# Altium project DAL_OBC_V11PrjPcb.PrjPcb (part 1 of 9)
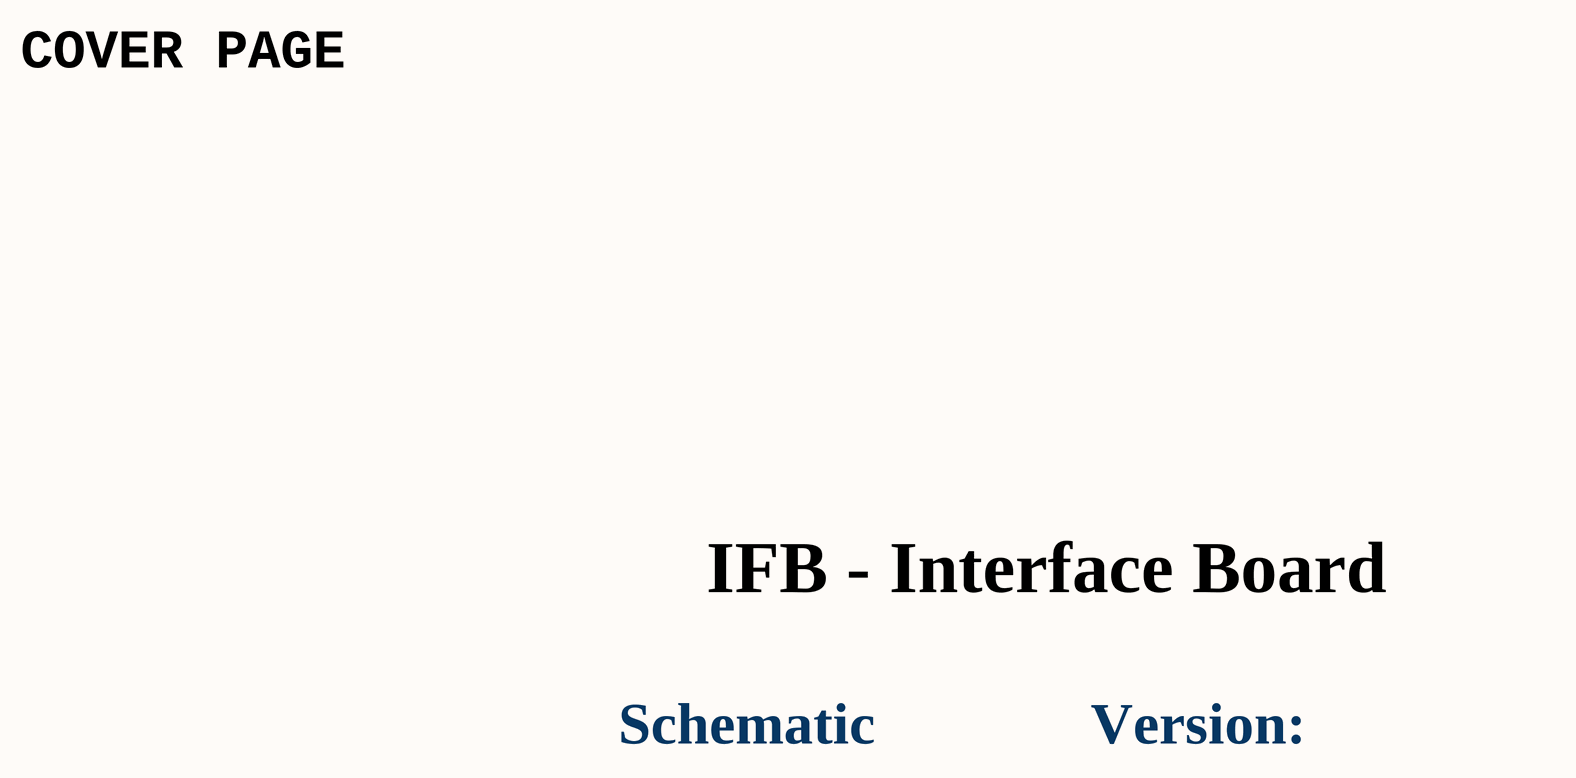
[diagram p0: CoverPage.SchDoc]
ApprovedBy: Vu Pham; CheckedBy: Bao Bui; Date: 09/09/2026; DrawnBy: Cam Doan; MasterProject: BEE-DAL; Revision: 1.1.0; SubSystem: OBC
34 sheets, 961 parts. Net scope: flat (ports and power ports of the same name join across sheets).
Board file: DAL_OBC_V10.PcbDoc
Sheets:
  CoverPage.SchDoc
  Index.SchDoc
  PowerTree.SchDoc
  BlockDiagram.SchDoc
  Power.SchDoc
  POWER_MANAGER.SchDoc
  CONNECTOR_IN.SchDoc
  CONNECTOR_BUS.SchDoc
  SAMA7G54_PMIC.SchDoc
  SAMA7G54_MPU.SchDoc
  SAMA7G54_PIO.SchDoc
  SAMA7G54_DDR3L.SchDoc
  SDCARD_MRAM.SchDoc
  eMMC.SchDoc
  USB_CAMERA_2.SchDoc
  USB_CAMERA.SchDoc
  DEBUG_CONSOLE.SchDoc
  TEMP.SchDoc
  RTC.SchDoc
  WATCHDOG.SchDoc
  CAN_PHY.SchDoc
  RS485.SchDoc
  RS422.SchDoc
  RS232.SchDoc
  BUTTON_LED.SchDoc
  MOUNTING_HOLE.SchDoc
  FPGA_POWER.SchDoc
  FPGA_POWER_2.SchDoc
  FPGA_BANK.SchDoc
  FPGA_FLASH_EEPROM.SchDoc
  FPGA_CONN_OUT.SchDoc
  ChangeNote.SchDoc
  MIPI_CSI.SchDoc
  NTC.SchDoc

## Sheet CoverPage.SchDoc
size 420 x 297 mm; SheetNumber: 1; SheetTotal: 34

### Notes on the sheet
- COVER PAGE
- IFB - Interface Board
- Schematic
- Version:
- Project:
- Sub-system:
- Design by:
- Sheet title:
- Sheet
- of
- Checked by:
- Approved by:
- Revision:
- Document No:
- Size:
- Date:
- A3

## Sheet Index.SchDoc
size 420 x 297 mm; SheetNumber: 2; SheetTotal: 34
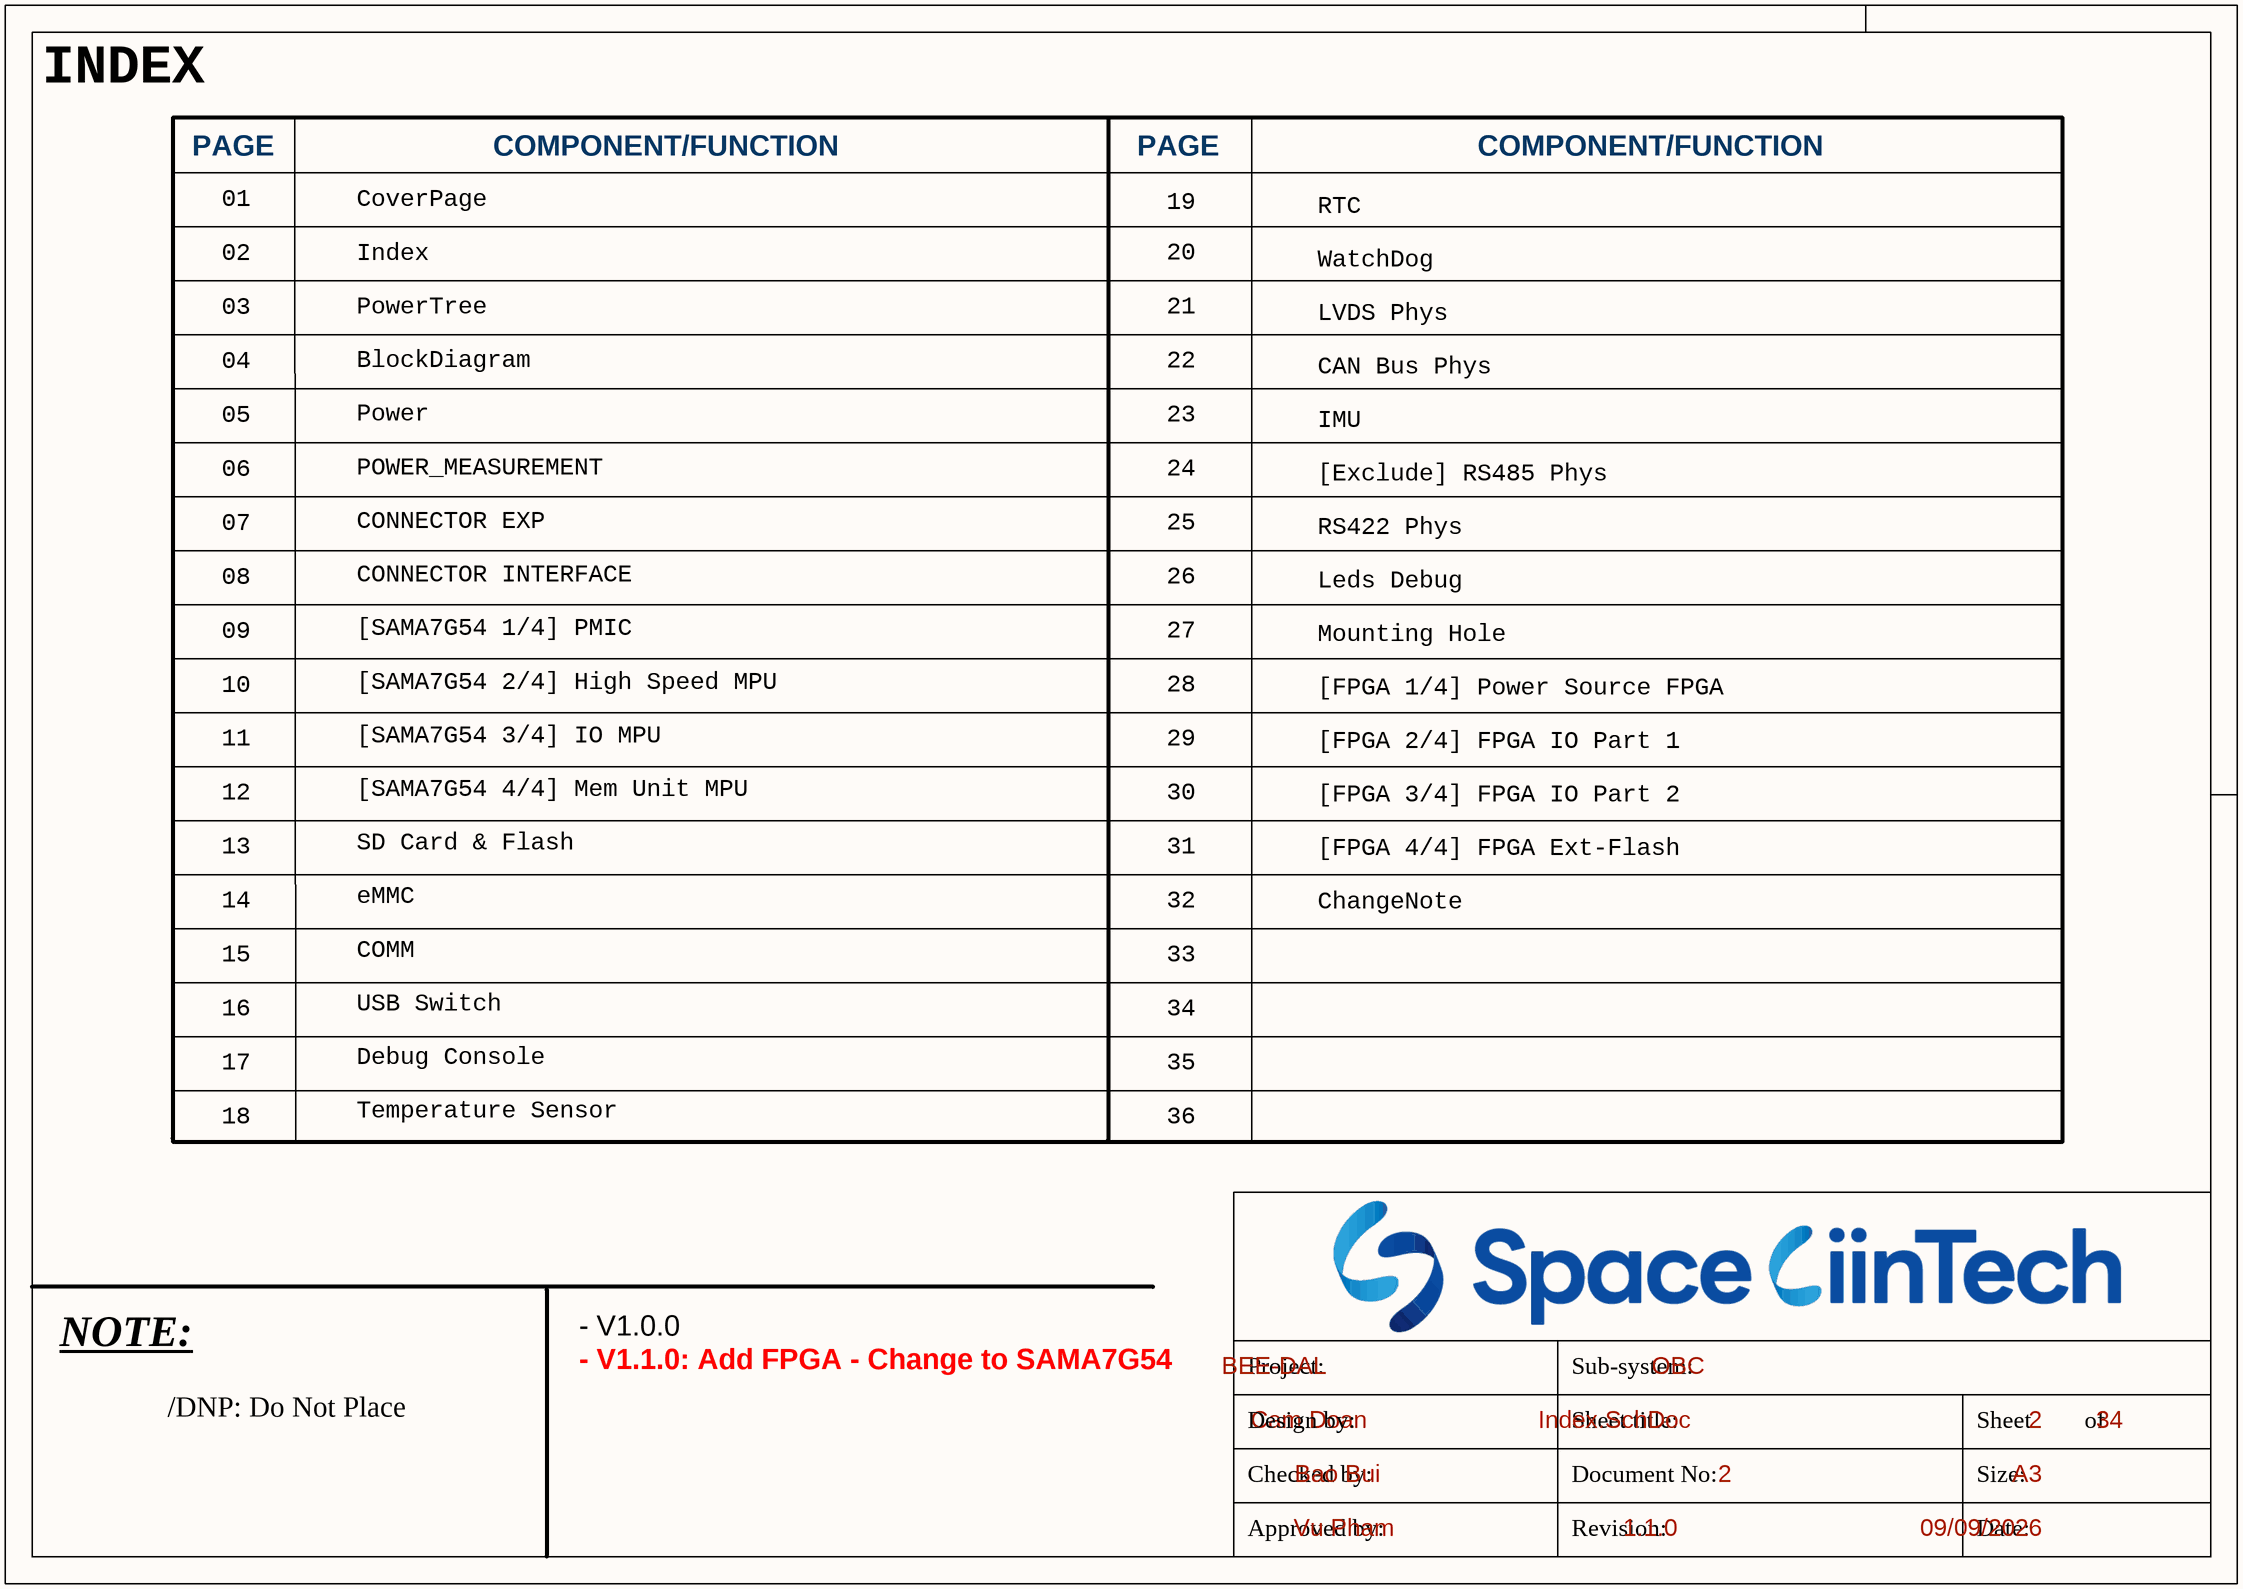
[diagram p1: Index.SchDoc]

### Notes on the sheet
- INDEX
- PAGE
- COMPONENT/FUNCTION
- 01
- 02
- CoverPage
- Index
- 19
- 20
- RTC
- 03
- PowerTree
- 21
- WatchDog
- LVDS Phys
- 04
- BlockDiagram
- 22
- CAN Bus Phys
- 05
- Power
- 23
- IMU
- 06
- 07
- CONNECTOR EXP
- POWER_MEASUREMENT
- 24
- 25
- [Exclude] RS485 Phys
- 08
- CONNECTOR INTERFACE
- 26
- RS422 Phys
- Leds Debug
- 09
- [SAMA7G54 1/4] PMIC
- 27
- Mounting Hole
- 10
- [SAMA7G54 2/4] High Speed MPU
- 28
- [FPGA 1/4] Power Source FPGA
- 11
- 12
- [SAMA7G54 3/4] IO MPU
- [SAMA7G54 4/4] Mem Unit MPU
- 29
- 30
- [FPGA 2/4] FPGA IO Part 1
- 13
- SD Card & Flash
- 31
- [FPGA 3/4] FPGA IO Part 2
- [FPGA 4/4] FPGA Ext-Flash
- 14
- eMMC
- 32
- ChangeNote
- 15
- COMM
- 33
- 16
- 17
- USB Switch
- Debug Console
- 34
- 35
- 18
- Temperature Sensor
- 36
- - V1.0.0
- NOTE:
- - V1.1.0: Add FPGA - Change to SAMA7G54
- /DNP: Do Not Place
- Project:
- Sub-system:
- Design by:
- Sheet title:
- Sheet
- of
- Checked by:
- Approved by:
- Revision:
- Document No:
- Size:
- Date:
- A3

## Sheet PowerTree.SchDoc
size 420 x 297 mm; SheetNumber: 3; SheetTotal: 34

### Notes on the sheet
- Project:
- Sub-system:
- Design by:
- Sheet title:
- Sheet
- of
- Checked by:
- Approved by:
- Revision:
- Document No:
- Size:
- Date:
- A3
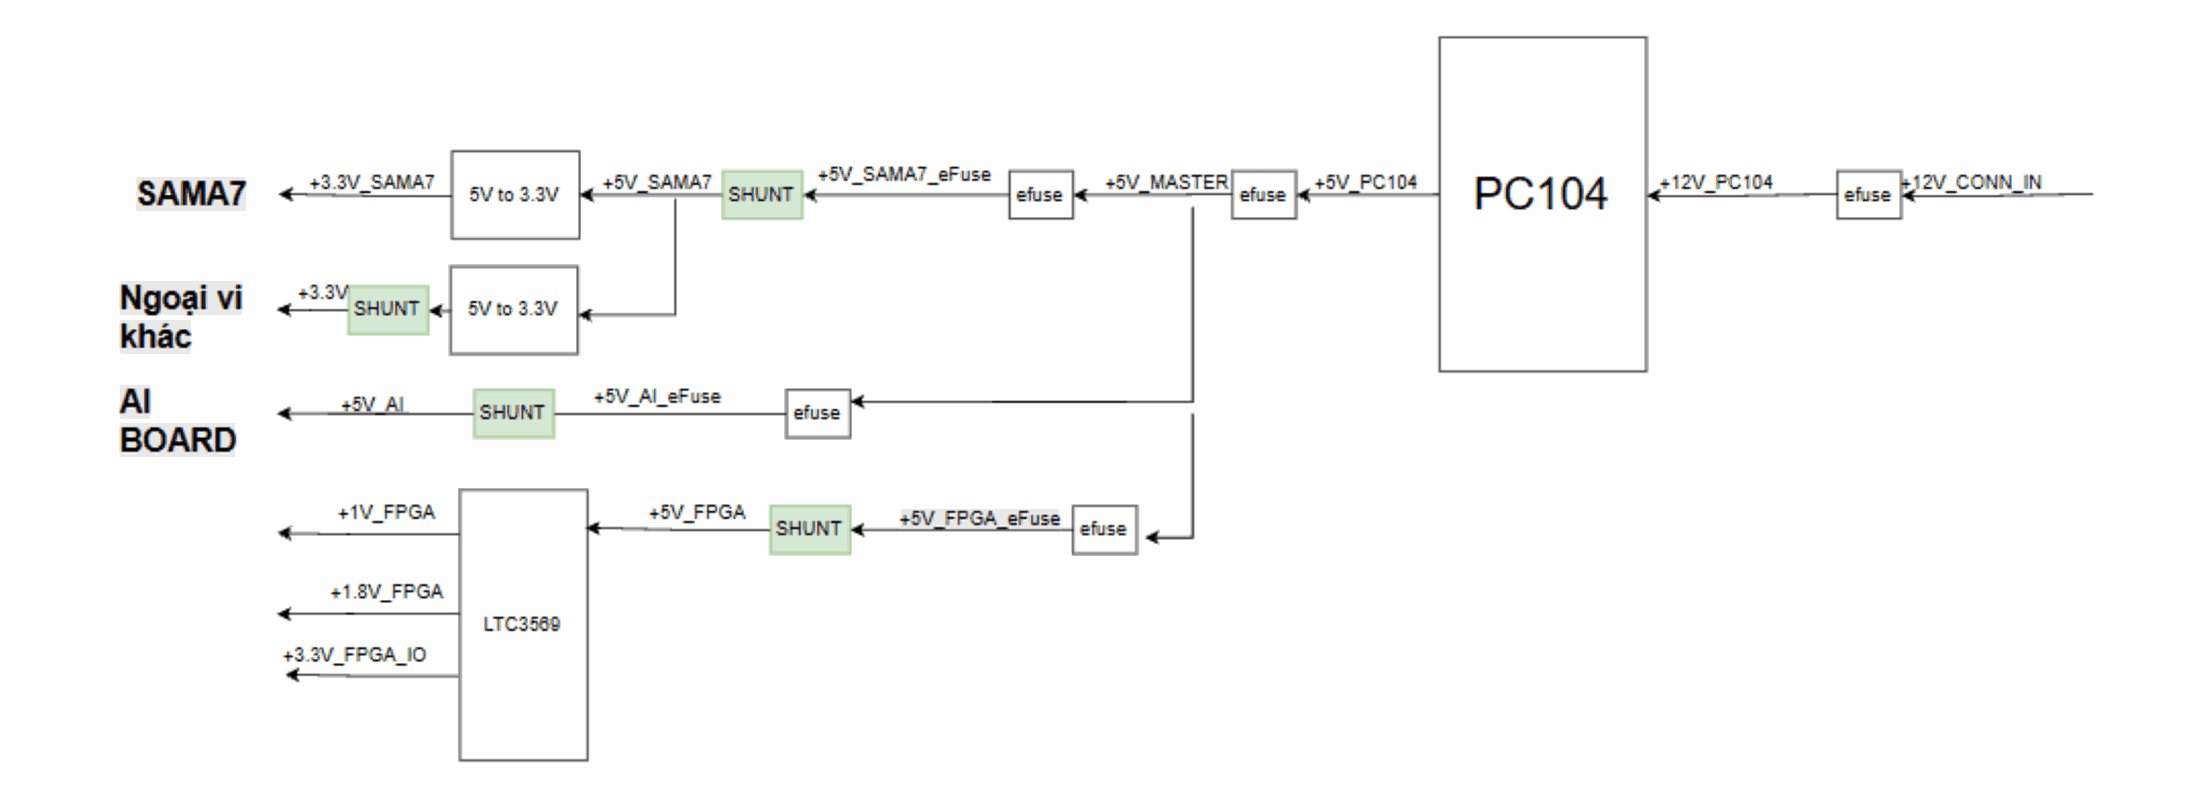
[diagram p2: PowerTree.SchDoc]

## Sheet BlockDiagram.SchDoc
size 420 x 297 mm; SheetNumber: 4; SheetTotal: 34
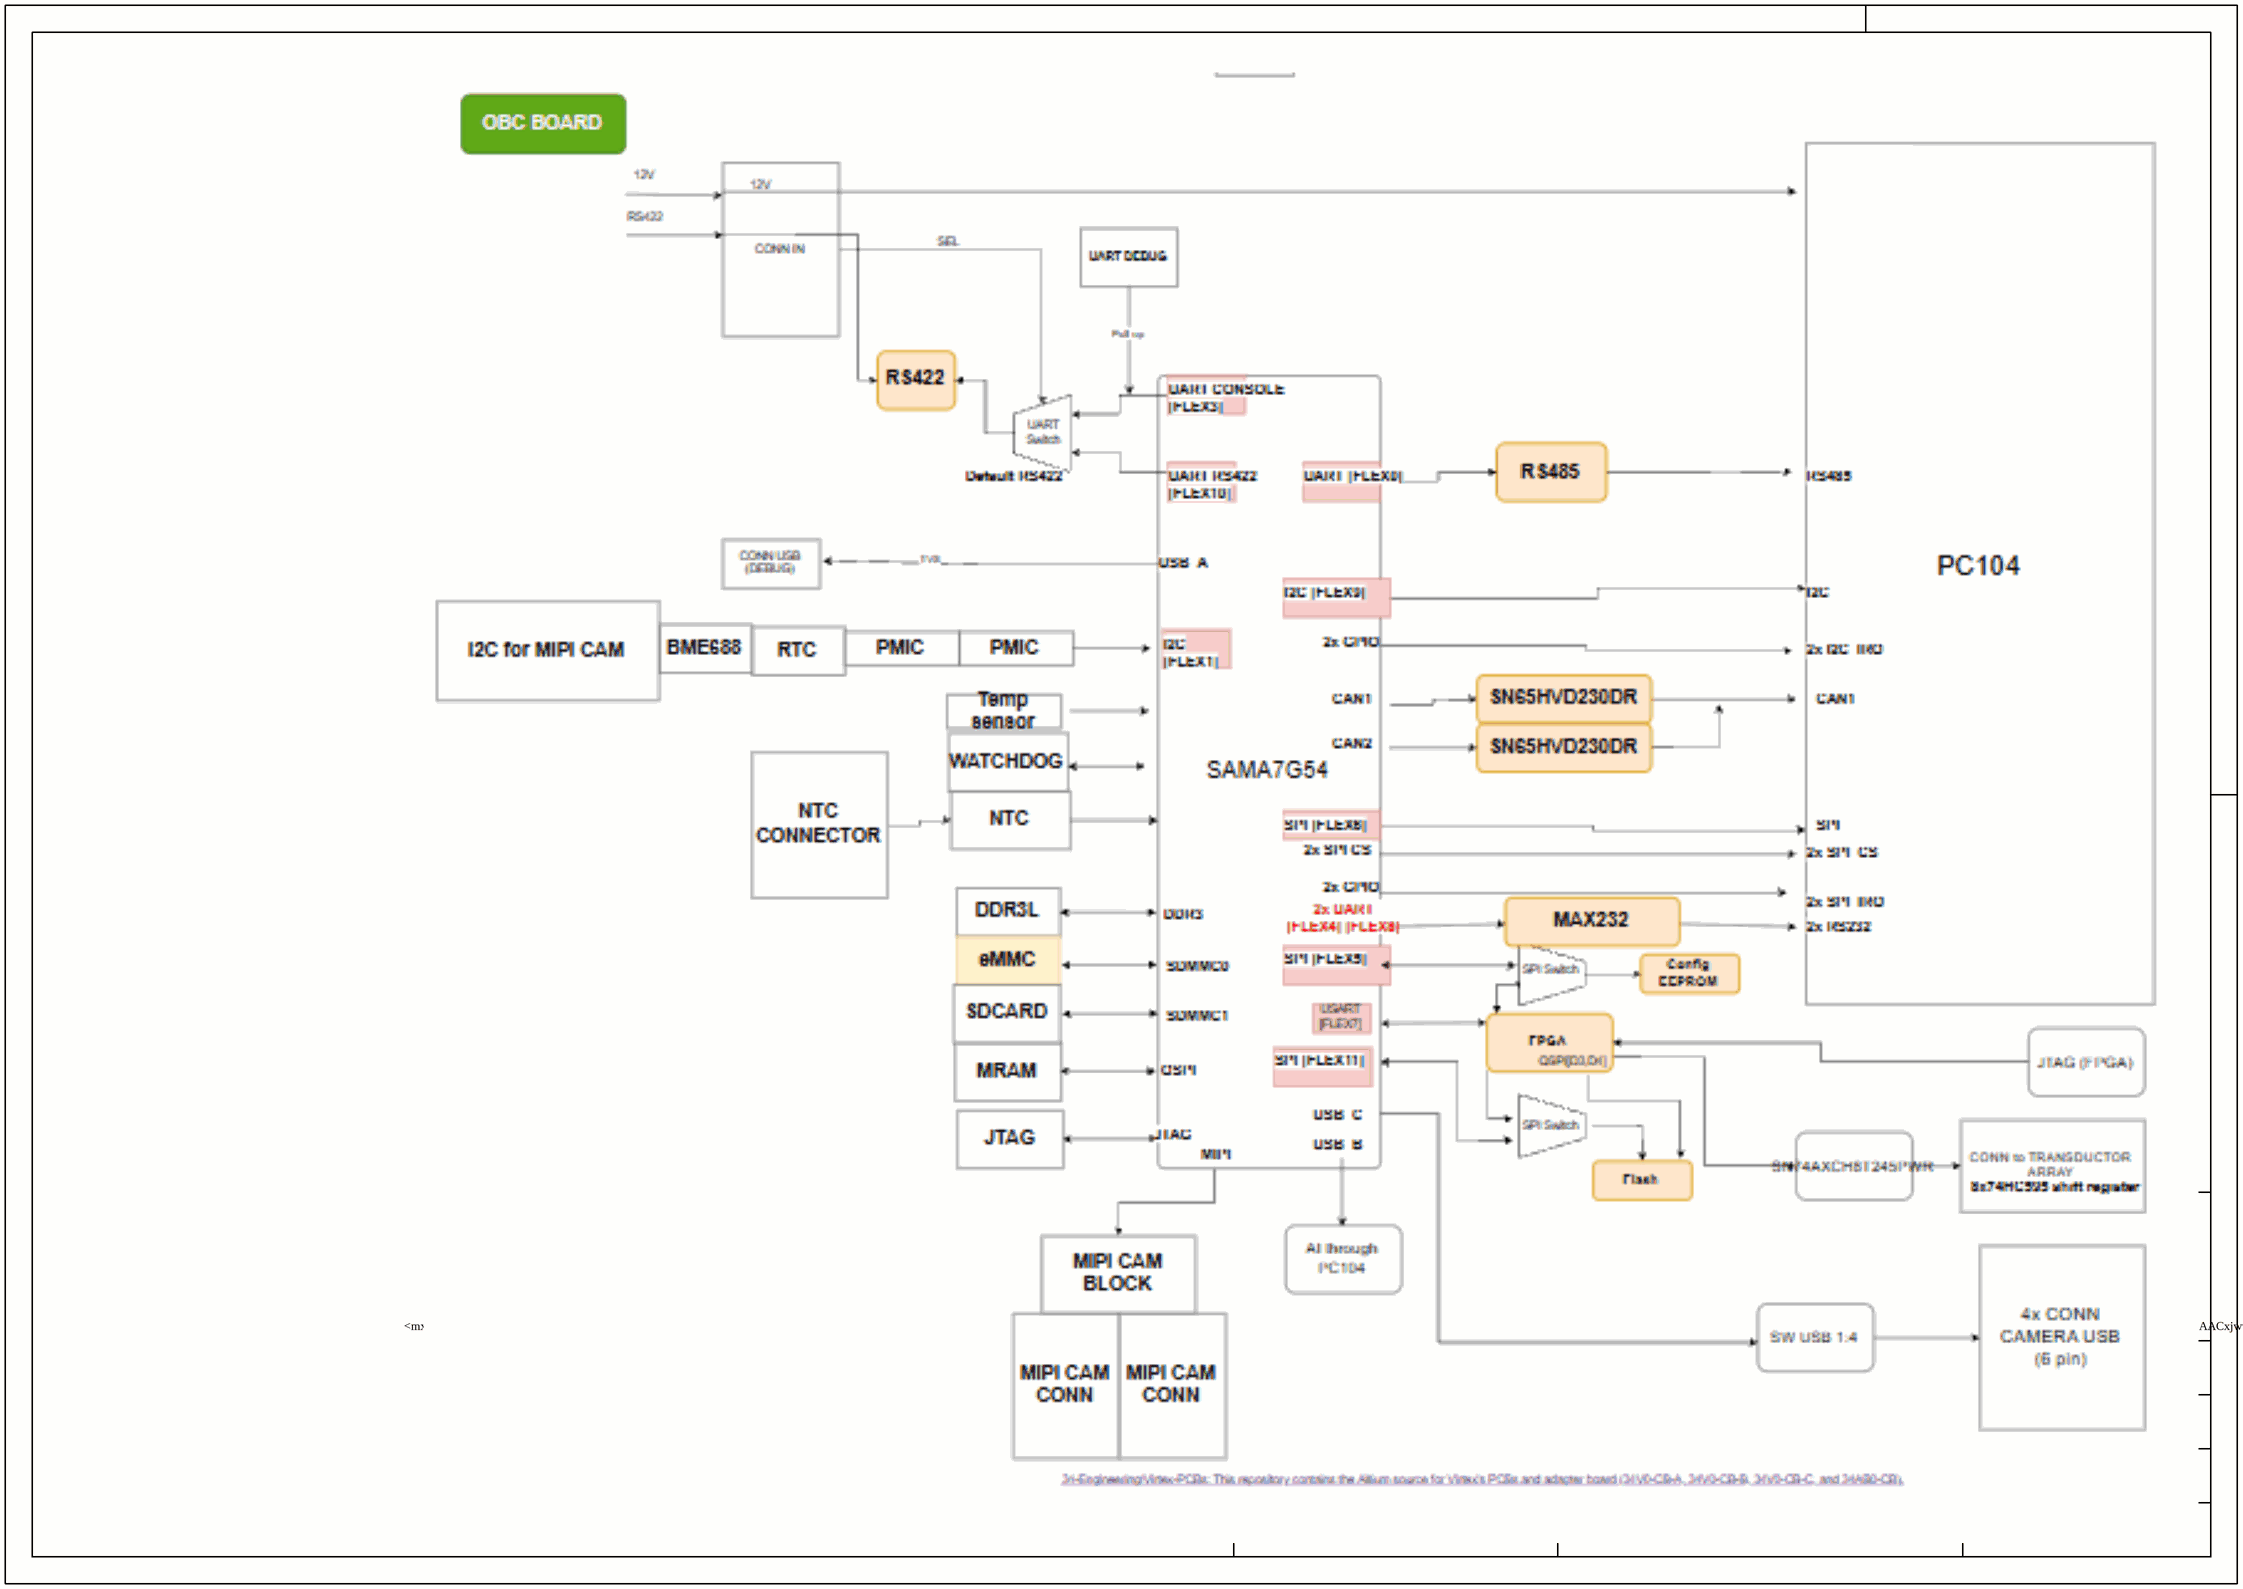
[diagram p3: BlockDiagram.SchDoc]
### Notes on the sheet